# Altium schematic sheet uC.SchDoc
size A3
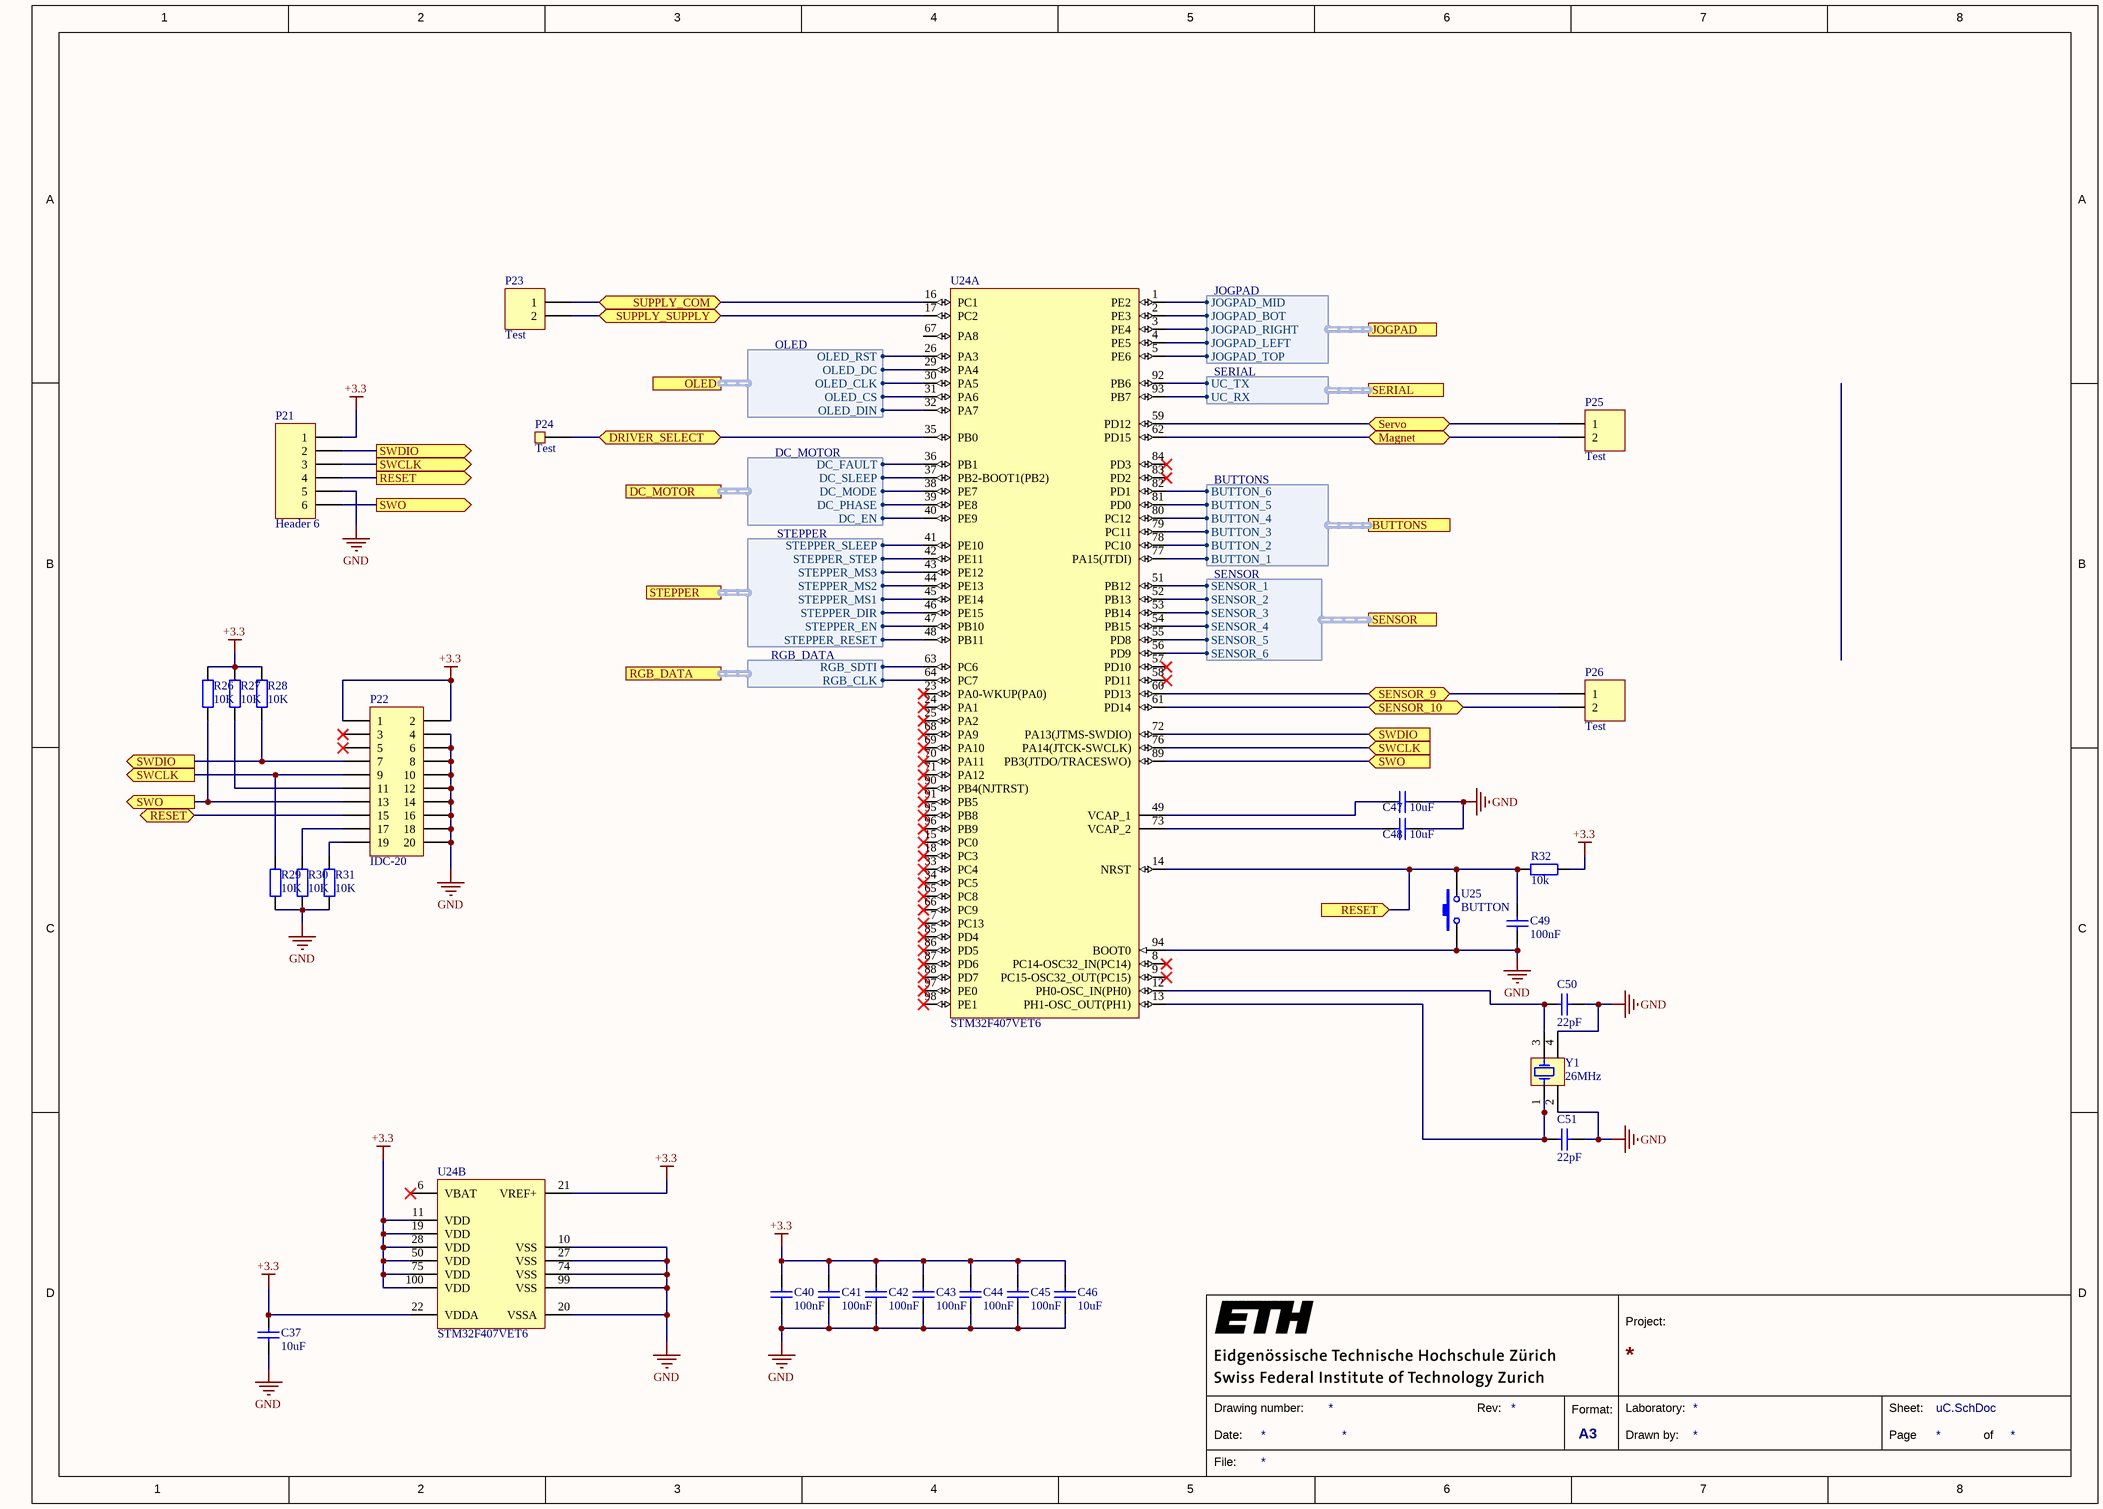
[diagram p0: uC.SchDoc]

## Parts
C37  10uF  [CAP_0603i_1608m -N]
C40  100nF  [CAP_0402i_1005m -N]
C41  100nF  [CAP_0402i_1005m -N]
C42  100nF  [CAP_0402i_1005m -N]
C43  100nF  [CAP_0402i_1005m -N]
C44  100nF  [CAP_0402i_1005m -N]
C45  100nF  [CAP_0402i_1005m -N]
C46  10uF  [CAP_0603i_1608m -N]
C47  10uF  [CAP_0603i_1608m -N]
C48  10uF  [CAP_0603i_1608m -N]
C49  100nF  [CAP_0402i_1005m -N]
C50  22pF  [CAP_0603i_1608m -N]
C51  22pF  [CAP_0603i_1608m -N]
P21  Header 6  [HDR1X6]
P22  IDC-20  [IDC-20]
P23  Test  [HDR1X2]
P24  Test  [PIN1]
P25  Test  [HDR1X2]
P26  Test  [HDR1X2]
R26  10K  [RES_0603i_1608m -N]
R27  10K  [RES_0603i_1608m -N]
R28  10K  [RES_0603i_1608m -N]
R29  10K  [RES_0603i_1608m -N]
R30  10K  [RES_0603i_1608m -N]
R31  10K  [RES_0603i_1608m -N]
R32  10k  [RES_0603i_1608m -N]
U24  STM32F407VET6  [STM-LQFP100_M]  (parts A,B of 2)
U25  BUTTON  [RND 210-00206]
Y1  26MHz  [TSX-3225 2*2.5]

## Ports
BUTTONS (harness BUTTONS), DC_MOTOR (harness DC_MOTOR), DRIVER_SELECT (bidir), JOGPAD (harness JOGPAD), Magnet (bidir), OLED (harness OLED), RESET (bidir), RESET (in), RESET (out), RGB_DATA (harness RGB_DATA), SENSOR (harness SENSOR), SENSOR_9 (bidir), SENSOR_10 (bidir), SERIAL (harness SERIAL), Servo (bidir), STEPPER (harness STEPPER), SUPPLY_COM (bidir), SUPPLY_SUPPLY (bidir), SWCLK (in), SWCLK (out), SWDIO (in), SWDIO (out), SWO (in), SWO (out)

## Harnesses
SENSOR: SENSOR_1, SENSOR_2, SENSOR_3, SENSOR_4, SENSOR_5, SENSOR_6
STEPPER: STEPPER_EN, STEPPER_STEP, STEPPER_MS1, STEPPER_MS2, STEPPER_MS3, STEPPER_DIR, STEPPER_RESET, STEPPER_SLEEP
DC_MOTOR: DC_SLEEP, DC_EN, DC_MODE, DC_PHASE, DC_FAULT
OLED: OLED_DIN, OLED_CLK, OLED_CS, OLED_DC, OLED_RST
JOGPAD: JOGPAD_TOP, JOGPAD_LEFT, JOGPAD_RIGHT, JOGPAD_BOT, JOGPAD_MID
BUTTONS: BUTTON_4, BUTTON_5, BUTTON_3, BUTTON_2, BUTTON_1, BUTTON_6
SERIAL: UC_RX, UC_TX
RGB_DATA: RGB_SDTI, RGB_CLK

## Nets
+3.3: C37.2 C40.1 C41.2 C42.2 C43.2 C44.2 C45.2 C46.2 P21.1 P22.1 P22.2 R26.2 R27.2 R28.2 R32.1 U24.11(VDD) U24.19(VDD) U24.21(VREF+) U24.22(VDDA) U24.28(VDD) U24.50(VDD) U24.75(VDD) U24.100(VDD)
GND: C37.1 C40.2 C41.1 C42.1 C43.1 C44.1 C45.1 C46.1 C47.1 C48.1 C49.1 C50.1 C51.1 P21.5 P22.4 P22.6 P22.8 P22.10 P22.12 P22.14 P22.16 P22.18 P22.20 R29.1 R30.1 R31.1 U24.10(VSS) U24.20(VSSA) U24.27(VSS) U24.74(VSS) U24.94(BOOT0) U24.99(VSS) U25.1 Y1.2(COM) Y1.4(COM)
DRIVER_SELECT: P24.1 U24.35(PB0) ; port DRIVER_SELECT
Magnet: P25.2 U24.62(PD15) ; port Magnet
RESET: C49.2 P21.4 P22.15 R32.2 U24.14(NRST) U25.2 ; port RESET
SENSOR_9: P26.1 U24.60(PD13) ; port SENSOR_9
SENSOR_10: P26.2 U24.61(PD14) ; port SENSOR_10
Servo: P25.1 U24.59(PD12) ; port Servo
SUPPLY_COM: P23.1 U24.16(PC1) ; port SUPPLY_COM
SUPPLY_SUPPLY: P23.2 U24.17(PC2) ; port SUPPLY_SUPPLY
SWCLK: P21.3 P22.9 R29.2 U24.76(PA14(JTCK-SWCLK)) ; port SWCLK
SWDIO: P21.2 P22.7 R28.1 U24.72(PA13(JTMS-SWDIO)) ; port SWDIO
SWO: P21.6 P22.13 R26.1 U24.89(PB3(JTDO/TRACESWO)) ; port SWO
NetC47_2: C47.2 U24.49(VCAP_1)
NetC48_2: C48.2 U24.73(VCAP_2)
NetC50_2: C50.2 U24.12(PH0-OSC_IN(PH0)) Y1.3(OSC2)
NetC51_2: C51.2 U24.13(PH1-OSC_OUT(PH1)) Y1.1(OSC1)
NetP22_11: P22.11 R27.1
NetP22_17: P22.17 R30.2
NetP22_19: P22.19 R31.2
NetU24_1: U24.1(PE2) ; port JOGPAD.JOGPAD_MID
NetU24_2: U24.2(PE3) ; port JOGPAD.JOGPAD_BOT
NetU24_3: U24.3(PE4) ; port JOGPAD.JOGPAD_RIGHT
NetU24_4: U24.4(PE5) ; port JOGPAD.JOGPAD_LEFT
NetU24_5: U24.5(PE6) ; port JOGPAD.JOGPAD_TOP
NetU24_26: U24.26(PA3) ; port OLED.OLED_RST
NetU24_29: U24.29(PA4) ; port OLED.OLED_DC
NetU24_30: U24.30(PA5) ; port OLED.OLED_CLK
NetU24_31: U24.31(PA6) ; port OLED.OLED_CS
NetU24_32: U24.32(PA7) ; port OLED.OLED_DIN
NetU24_36: U24.36(PB1) ; port DC_MOTOR.DC_FAULT
NetU24_37: U24.37(PB2-BOOT1(PB2)) ; port DC_MOTOR.DC_SLEEP
NetU24_38: U24.38(PE7) ; port DC_MOTOR.DC_MODE
NetU24_39: U24.39(PE8) ; port DC_MOTOR.DC_PHASE
NetU24_40: U24.40(PE9) ; port DC_MOTOR.DC_EN
NetU24_41: U24.41(PE10) ; port STEPPER.STEPPER_SLEEP
NetU24_42: U24.42(PE11) ; port STEPPER.STEPPER_STEP
NetU24_43: U24.43(PE12) ; port STEPPER.STEPPER_MS3
NetU24_44: U24.44(PE13) ; port STEPPER.STEPPER_MS2
NetU24_45: U24.45(PE14) ; port STEPPER.STEPPER_MS1
NetU24_46: U24.46(PE15) ; port STEPPER.STEPPER_DIR
NetU24_47: U24.47(PB10) ; port STEPPER.STEPPER_EN
NetU24_48: U24.48(PB11) ; port STEPPER.STEPPER_RESET
NetU24_51: U24.51(PB12) ; port SENSOR.SENSOR_1
NetU24_52: U24.52(PB13) ; port SENSOR.SENSOR_2
NetU24_53: U24.53(PB14) ; port SENSOR.SENSOR_3
NetU24_54: U24.54(PB15) ; port SENSOR.SENSOR_4
NetU24_55: U24.55(PD8) ; port SENSOR.SENSOR_5
NetU24_56: U24.56(PD9) ; port SENSOR.SENSOR_6
NetU24_63: U24.63(PC6) ; port RGB_DATA.RGB_SDTI
NetU24_64: U24.64(PC7) ; port RGB_DATA.RGB_CLK
NetU24_77: U24.77(PA15(JTDI)) ; port BUTTONS.BUTTON_1
NetU24_78: U24.78(PC10) ; port BUTTONS.BUTTON_2
NetU24_79: U24.79(PC11) ; port BUTTONS.BUTTON_3
NetU24_80: U24.80(PC12) ; port BUTTONS.BUTTON_4
NetU24_81: U24.81(PD0) ; port BUTTONS.BUTTON_5
NetU24_82: U24.82(PD1) ; port BUTTONS.BUTTON_6
NetU24_92: U24.92(PB6) ; port SERIAL.UC_TX
NetU24_93: U24.93(PB7) ; port SERIAL.UC_RX

Not connected (* = marked no-connect by the designer): P22 3* 5*; U24 6(VBAT)* 7(PC13)* 8(PC14-OSC32_IN(PC14))* 9(PC15-OSC32_OUT(PC15))* 15(PC0)* 18(PC3)* 23(PA0-WKUP(PA0))* 24(PA1)* 25(PA2)* 33(PC4)* 34(PC5)* 57(PD10)* 58(PD11)* 65(PC8)* 66(PC9)* 67(PA8) 68(PA9)* 69(PA10)* 70(PA11)* 71(PA12)* 83(PD2)* 84(PD3)* 85(PD4)* 86(PD5)* 87(PD6)* 88(PD7)* 90(PB4(NJTRST))* 91(PB5)* 95(PB8)* 96(PB9)* 97(PE0)* 98(PE1)*

## Notes on the sheet
- 1
- 2
- 3
- 4
- 5
- 6
- 7
- 8
- A
- B
- C
- D
- Project:
- Date:
- Drawing number:
- Rev:
- Format:
- A3
- Drawn by:
- Laboratory:
- Page
- Sheet:
- of
- File:

## Library data of the parts
C37 C40-C51 = Cap: capacitor
P21 = Header 6: Header, 6-Pin
P22 = IDC-20: Connector; IDC, Male Header, Thru-Hole; 20 Position; Vertical; Pitch 2.54 mm; B
P23 P25 P26 = Header 2: Header, 2-Pin
P24 = Pad: Single Pad or Testpoint
R26-R32 = Res: Resistor
U24 = CMP-0243-00016-3: ARM Cortex-M4 32-bit MCU+FPU, 210 DMIPS, 512 kB Flash, 192 kB Internal RAM, 82 I/Os, 100-pin LQFP, -40 to 85 degC, Tray; Manufacturer: STMicroelectronics; Supply Voltage(Vcc) max (V): 3.6; Supply Voltage(Vcc) min (V): 1.8; I/Os (High Current): 82; FLASH Size (Prog) (kB): 512; Operating Frequency(F) (Processor speed) (MHz): 168; D/A Converter: 2x12-bit; Internal RAM Size (kB): 192; PackageReference: LQFP100; Core: ARM Cortex-M4; ComponentLink1URL: http://www.st.com/web/en/home.html; ComponentLink1Description: Manufacturer URL; DatasheetVersion: Rev. 4; Packing: Tray; Mounting Technology: Surface Mount; ComponentLink2Description: Datasheet; ComponentLink2URL: http://www.st.com/st-web-ui/static/active/en/resource/technical/document/datasheet/DM00037051.pdf; ComponentLink3Description: Package Specification; PartNumber: STM32F407VET6; PackageVersion: Rev. 1, 06/2013; PackageDescription: 100-Pin Low Profile Quad Flat Package, 14 x 14 mm Body, 0.5 mm Pitch; ComponentLink3URL: http://www.st.com/st-web-ui/static/active/en/resource/technical/document/data_brief/DM00071938.pdf
Y1 = XTAL3: Industrial Ceramic Resonator